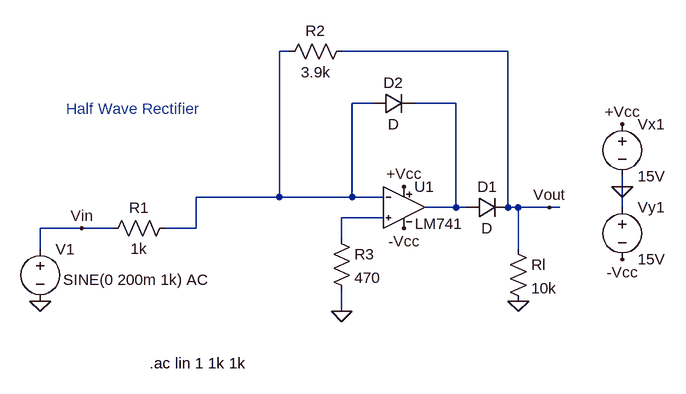
[diagram p0: schematic lab7.asc]
lab7.asc, the LTspice schematic file:
Version 4
SHEET 1 880 680
WIRE 32 -80 16 -80
WIRE 368 -80 112 -80
WIRE 160 0 128 0
WIRE 288 0 224 0
WIRE 544 128 544 112
WIRE 16 144 16 -80
WIRE 16 144 -112 144
WIRE 128 144 128 0
WIRE 128 144 16 144
WIRE 176 144 128 144
WIRE 288 160 288 0
WIRE 288 160 240 160
WIRE 304 160 288 160
WIRE 368 160 368 -80
WIRE 384 160 368 160
WIRE 432 160 384 160
WIRE 448 160 432 160
WIRE 544 160 544 128
WIRE 176 176 112 176
WIRE -288 192 -352 192
WIRE -240 192 -288 192
WIRE -112 192 -112 144
WIRE -112 192 -160 192
WIRE 112 208 112 176
WIRE -352 224 -352 192
WIRE 384 224 384 160
WIRE 112 320 112 288
FLAG 544 128 0
FLAG 544 32 +Vcc
FLAG 544 240 -Vcc
FLAG -352 304 0
FLAG -288 192 Vin
FLAG 112 320 0
FLAG 432 160 Vout
FLAG 384 304 0
FLAG 208 128 +Vcc
FLAG 208 192 -Vcc
SYMBOL LM741 208 96 R0
SYMATTR InstName U1
SYMBOL voltage 544 16 R0
SYMATTR InstName Vx1
SYMATTR Value 15V
SYMBOL voltage 544 144 R0
SYMATTR InstName Vy1
SYMATTR Value 15V
SYMBOL res -144 176 R90
WINDOW 0 0 56 VBottom 2
WINDOW 3 32 56 VTop 2
SYMATTR InstName R1
SYMATTR Value 1k
SYMBOL voltage -352 208 R0
WINDOW 3 35 63 Left 2
WINDOW 123 24 124 Left 2
WINDOW 39 0 0 Left 2
SYMATTR Value SINE(0 200m 1k) AC
SYMATTR InstName V1
SYMBOL res 96 192 R0
SYMATTR InstName R3
SYMATTR Value 470
SYMBOL diode 304 176 R270
WINDOW 0 32 32 VTop 2
WINDOW 3 0 32 VBottom 2
SYMATTR InstName D1
SYMBOL diode 160 16 R270
WINDOW 0 32 32 VTop 2
WINDOW 3 0 32 VBottom 2
SYMATTR InstName D2
SYMBOL res 368 208 R0
SYMATTR InstName Rl
SYMATTR Value 10k
SYMBOL res 128 -96 R90
WINDOW 0 0 56 VBottom 2
WINDOW 3 32 56 VTop 2
SYMATTR InstName R2
SYMATTR Value 3.9k
TEXT -184 400 Left 2 !.ac lin 1 1k 1k
TEXT -312 8 Left 2 ;Half Wave Rectifier

The netlist it stands for:
* lab7.asc
XU1 N003 N001 +Vcc -Vcc N002 LM741  ; pins In+ In- V+ V- OUT
Vx1 +Vcc 0 15V
Vy1 0 -Vcc 15V
R1 N001 Vin 1k
V1 Vin 0 SINE(0 200m 1k) AC
R3 N003 0 470
D1 N002 Vout D
D2 N001 N002 D
Rl Vout 0 10k
R2 Vout N001 3.9k
.model D D
.lib standard.dio
.ac lin 1 1k 1k
* Half Wave Rectifier
.lib LM741.lib
.backanno
.end